# Altium schematic sheet Mini-WaveGen.SchDoc
size A4; SheetNumber: 3; SheetTotal: 7
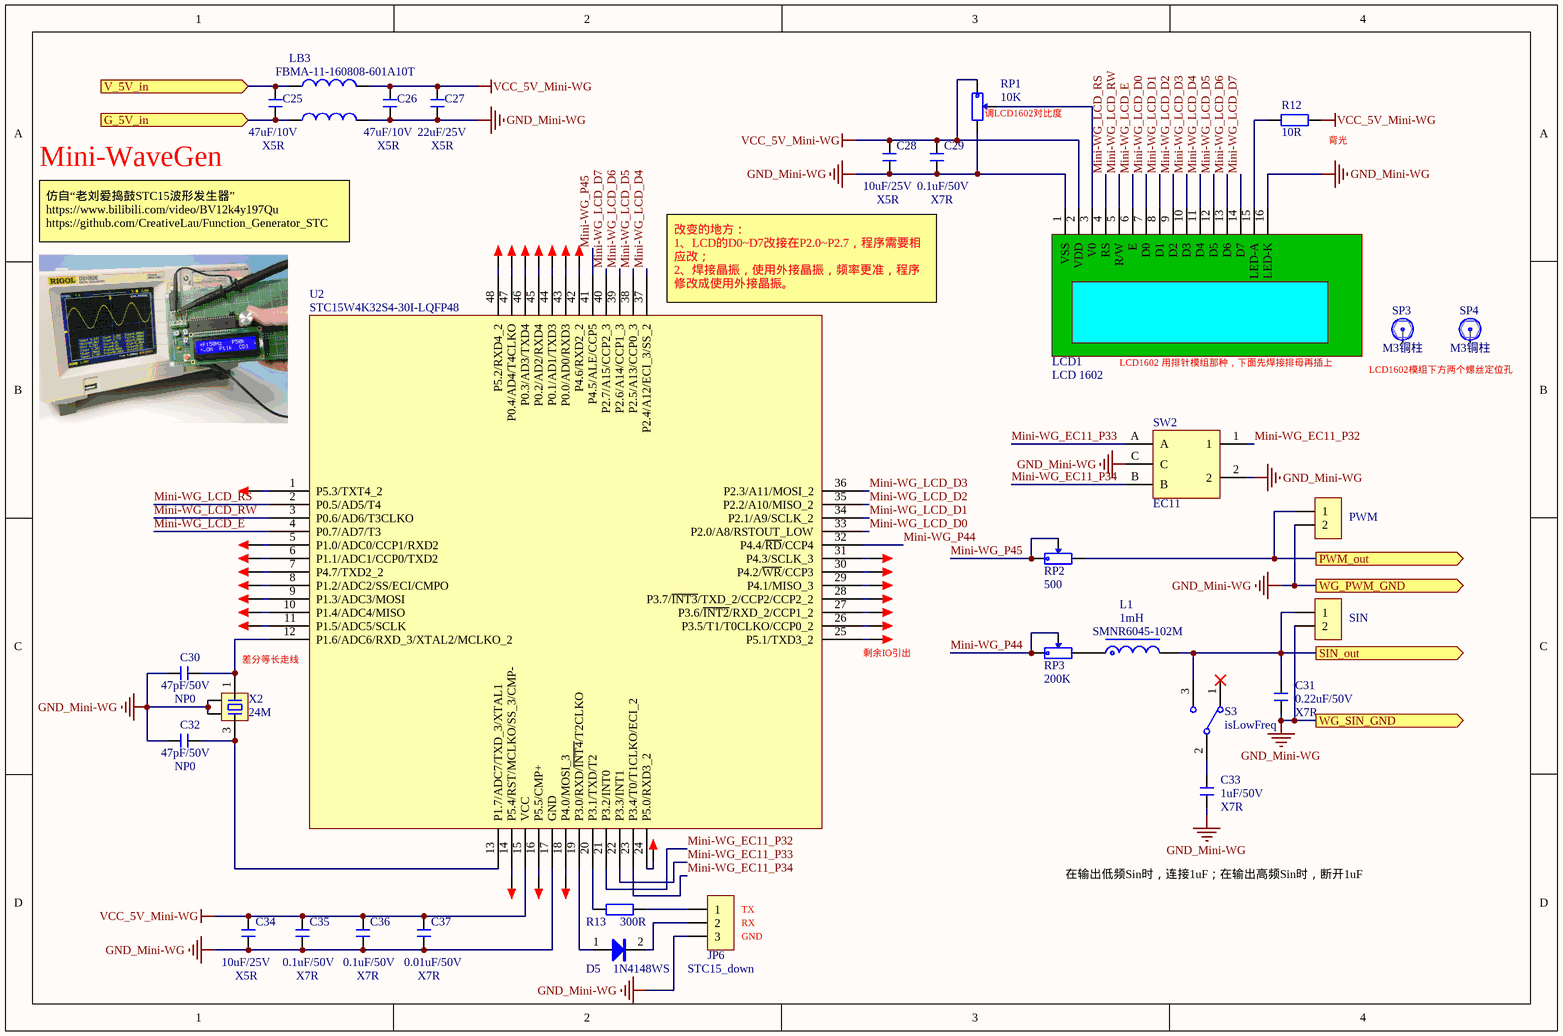
[diagram p0: Mini-WaveGen.SchDoc]

## Parts
C25  47uF/10V  BOM名称: X5R  [C 1206_L]
C26  47uF/10V  BOM名称: X5R  [C 1206_L]
C27  22uF/25V  BOM名称: X5R  [C 0805_L]
C28  10uF/25V  BOM名称: X5R  [C 0603_L]
C29  0.1uF/50V  BOM名称: X7R  [C 0402_L]
C30  47pF/50V  BOM名称: NP0  [C 0402_L]
C31  0.22uF/50V  BOM名称: X7R  [C 0603_L]
C32  47pF/50V  BOM名称: NP0  [C 0402_L]
C33  1uF/50V  BOM名称: X7R  [C 0603_L]
C34  10uF/25V  BOM名称: X5R  [C 0603_L]
C35  0.1uF/50V  BOM名称: X7R  [C 0402_L]
C36  0.1uF/50V  BOM名称: X7R  [C 0402_L]
C37  0.01uF/50V  BOM名称: X7R  [C 0402_L]
D5  1N4148WS  [SOD-323]
JP4  PWM  [HDR2.54-WS-2P]
JP5  SIN  [HDR2.54-WS-2P]
JP6  STC15_down  [HDR2.54-WS-3P]
L1  1mH  [NR6045]
LB3  FBMA-11-160808-601A10T  [FB 0603_L]
LB4  FBMA-11-160808-601A10T  [FB 0603_L]  (value not drawn)
LCD1  LCD 1602  [LCD-1602]
R12  10R  [R 0805_L]
R13  300R  [R 0402_L]
RP1  10K  [3362P]
RP2  500  [3362P]
RP3  200K  [3362P]
S3  isLowFreq  [MSK-12C01-07]
SP3  M3铜柱  [M3x4_L]
SP4  M3铜柱  [M3x4_L]
SW2  EC11  [EC11-B]
TP4  IO  [TEST 1]  (value not drawn)
TP5  IO  [TEST 1]  (value not drawn)
TP6  IO  [TEST 1]  (value not drawn)
TP7  IO  [TEST 1]  (value not drawn)
TP8  IO  [TEST 1]  (value not drawn)
TP9  IO  [TEST 1]  (value not drawn)
TP10  IO  [TEST 1]  (value not drawn)
TP11  IO  [TEST 1]  (value not drawn)
TP12  IO  [TEST 1]  (value not drawn)
TP13  IO  [TEST 1]  (value not drawn)
TP14  IO  [TEST 1]  (value not drawn)
TP15  IO  [TEST 1]  (value not drawn)
TP16  IO  [TEST 1]  (value not drawn)
TP17  IO  [TEST 1]  (value not drawn)
TP18  IO  [TEST 1]  (value not drawn)
TP19  IO  [TEST 1]  (value not drawn)
TP20  IO  [TEST 1]  (value not drawn)
TP21  IO  [TEST 1]  (value not drawn)
TP22  IO  [TEST 1]  (value not drawn)
TP23  IO  [TEST 1]  (value not drawn)
TP24  IO  [TEST 1]  (value not drawn)
TP25  IO  [TEST 1]  (value not drawn)
TP26  IO  [TEST 1]  (value not drawn)
TP27  IO  [TEST 1]  (value not drawn)
TP28  IO  [TEST 1]  (value not drawn)
TP29  IO  [TEST 1]  (value not drawn)
U2  STC15W4K32S4-30I-LQFP48  [LQFP48]
X2  24M  [OSC 3225-4P]

## Ports
G_5V_in (in), PWM_out (out), SIN_out (out), V_5V_in (in), WG_PWM_GND (out), WG_SIN_GND (out)

## Nets
GND_Mini-WG: C26.1 C27.1 C28.1 C29.2 C30.2 C31.2 C32.2 C33.1 C34.1 C35.2 C36.2 C37.2 JP4.2 JP5.2 JP6.3 LB4.2 LCD1.1(VSS) LCD1.16(LED-K) RP1.3 SW2.2 SW2.C U2.17(GND) X2.2 X2.4 ; port WG_PWM_GND, port WG_SIN_GND
VCC_5V_Mini-WG: C26.2 C27.2 C28.2 C29.1 C34.2 C35.1 C36.1 C37.1 LB3.2 LCD1.2(VDD) R12.1 RP1.1 U2.15(VCC)
G_5V_in: C25.1 LB4.1 ; port G_5V_in
Mini-WG_EC11_P32: SW2.1 U2.21(P3.2/INT0)
Mini-WG_EC11_P33: SW2.A U2.22(P3.3/INT1)
Mini-WG_EC11_P34: SW2.B U2.23(P3.4/T0/T1CLKO/ECI_2)
Mini-WG_LCD_D0: LCD1.7(D0) U2.33(P2.0/A8/RSTOUT_LOW)
Mini-WG_LCD_D1: LCD1.8(D1) U2.34(P2.1/A9/SCLK_2)
Mini-WG_LCD_D2: LCD1.9(D2) U2.35(P2.2/A10/MISO_2)
Mini-WG_LCD_D3: LCD1.10(D3) U2.36(P2.3/A11/MOSI_2)
Mini-WG_LCD_D4: LCD1.11(D4) U2.37(P2.4/A12/ECI_3/SS_2)
Mini-WG_LCD_D5: LCD1.12(D5) U2.38(P2.5/A13/CCP0_3)
Mini-WG_LCD_D6: LCD1.13(D6) U2.39(P2.6/A14/CCP1_3)
Mini-WG_LCD_D7: LCD1.14(D7) U2.40(P2.7/A15/CCP2_3)
Mini-WG_LCD_E: LCD1.6(E) U2.4(P0.7/AD7/T3)
Mini-WG_LCD_RS: LCD1.4(RS) U2.2(P0.5/AD5/T4)
Mini-WG_LCD_RW: LCD1.5(R/W) U2.3(P0.6/AD6/T3CLKO)
Mini-WG_P44: RP3.1 RP3.2 U2.32(P4.4/~{RD}/CCP4)
Mini-WG_P45: RP2.1 RP2.2 U2.41(P4.5/ALE/CCP5)
PWM_out: JP4.1 RP2.3 ; port PWM_out
SIN_out: C31.1 JP5.1 L1.2 S3.3 ; port SIN_out
V_5V_in: C25.2 LB3.1 ; port V_5V_in
NetC30_1: C30.1 U2.12(P1.6/ADC6/RXD_3/XTAL2/MCLKO_2) X2.1
NetC32_1: C32.1 U2.13(P1.7/ADC7/TXD_3/XTAL1) X2.3
NetC33_2: C33.2 S3.2
NetD5_1: D5.1(A) U2.19(P3.0/RXD/~{INT4}/T2CLKO)
NetD5_2: D5.2(K) JP6.2
NetJP6_1: JP6.1 R13.1
NetL1_1: L1.1 RP3.3
NetLCD1_3: LCD1.3(V0) RP1.2
NetLCD1_15: LCD1.15(LED-A) R12.2
NetR13_2: R13.2 U2.20(P3.1/TXD/T2)
NetTP4_1: TP4.1 U2.48(P5.2/RXD4_2)
NetTP5_1: TP5.1 U2.47(P0.4/AD4/T4CLKO)
NetTP6_1: TP6.1 U2.46(P0.3/AD3/TXD4)
NetTP7_1: TP7.1 U2.45(P0.2/AD2/RXD4)
NetTP8_1: TP8.1 U2.44(P0.1/AD1/TXD3)
NetTP9_1: TP9.1 U2.43(P0.0/AD0/RXD3)
NetTP10_1: TP10.1 U2.42(P4.6/RXD2_2)
NetTP11_1: TP11.1 U2.1(P5.3/TXT4_2)
NetTP12_1: TP12.1 U2.31(P4.3/SCLK_3)
NetTP13_1: TP13.1 U2.5(P1.0/ADC0/CCP1/RXD2)
NetTP14_1: TP14.1 U2.30(P4.2/~{WR}/CCP3)
NetTP15_1: TP15.1 U2.6(P1.1/ADC1/CCP0/TXD2)
NetTP16_1: TP16.1 U2.29(P4.1/MISO_3)
NetTP17_1: TP17.1 U2.7(P4.7/TXD2_2)
NetTP18_1: TP18.1 U2.28(P3.7/~{INT3}/TXD_2/CCP2/CCP2_2)
NetTP19_1: TP19.1 U2.8(P1.2/ADC2/SS/ECI/CMPO)
NetTP20_1: TP20.1 U2.27(P3.6/~{INT2}/RXD_2/CCP1_2)
NetTP21_1: TP21.1 U2.9(P1.3/ADC3/MOSI)
NetTP22_1: TP22.1 U2.26(P3.5/T1/T0CLKO/CCP0_2)
NetTP23_1: TP23.1 U2.10(P1.4/ADC4/MISO)
NetTP24_1: TP24.1 U2.25(P5.1/TXD3_2)
NetTP25_1: TP25.1 U2.11(P1.5/ADC5/SCLK)
NetTP26_1: TP26.1 U2.24(P5.0/RXD3_2)
NetTP27_1: TP27.1 U2.14(P5.4/RST/MCLKO/SS_3/CMP-)
NetTP28_1: TP28.1 U2.16(P5.5/CMP+)
NetTP29_1: TP29.1 U2.18(P4.0/MOSI_3)

Not connected (* = marked no-connect by the designer): S3 1*; SP3 1; SP4 1

## Notes on the sheet
- (near RP1) 调LCD1602对比度
- Mini-WaveGen
- (near R12) 背光
- 仿自“老刘爱捣鼓STC15波形发生器”
  https://www.bilibili.com/video/BV12k4y197Qu
  https://github.com/CreativeLau/Function_Generator_STC
- (near U2) 改变的地方：
  1、LCD的D0~D7改接在P2.0~P2.7，程序需要相应改；
  2、焊接晶振，使用外接晶振，频率更准，程序修改成使用外接晶振。
- LCD1602 用排针模组那种，下面先焊接排母再插上
- LCD1602模组下方两个螺丝定位孔
- (near TP24) 剩余IO引出
- 差分等长走线
- (near JP6) TX
- (near JP6) RX
- 在输出低频Sin时，连接1uF；在输出高频Sin时，断开1uF
- (near JP6) GND
- Title
- Start date:
- Revision:
- Sheet
- Last date:
- of
- Organization:
- Drawn by:
- Checked by:
- Size:
- A4

## Library data of the parts
C25-C28 C34 = C X5R: 无极性贴片电容 X5R
C29 C31 C33 C35-C37 = C X7R: 无极性贴片电容 X7R
C30 C32 = C NP0: 无极性贴片电容 NP0
D5 = 1N4148: 高速开关二极管; 版权归属: 源创客; BOM名称: 高速开关二极管; 学习资源: www.ooocke.com
JP4 JP5 = Header 2: 2P接插件; 版权归属: 源创客; BOM名称: 2P接插件; 学习资源: www.ooocke.com
JP6 = Header 3: 3P接插件; 版权归属: 源创客; BOM名称: 3P接插件; 学习资源: www.ooocke.com
L1 = L-NR: SMNR6045-102M; 版权归属: 源创客; BOM名称: SMNR6045-102M; 学习资源: www.ooocke.com
LB3 LB4 = LB: 磁珠 600R@100MHz; 版权归属: 源创客; BOM名称: 磁珠 600R@100MHz; 学习资源: www.ooocke.com
LCD1 = LCD 1602: 版权归属: 源创客; BOM名称: LCD 1602; 学习资源: www.ooocke.com
R12 R13 = R: 贴片电阻 E-96 1%; BOM名称: E-96 1%
RP1-RP3 = RP-ID: 插件单联电位器; BOM名称: 插件电位器; 版权归属: 源创客; 学习资源: www.ooocke.com
S3 = SSW-1P: 1路拨动开关; pin to pad: 1>3 3>1; BOM名称: 拨动开关; 版权归属: 源创客; 学习资源: www.ooocke.com
SP3 SP4 = 铜柱小焊盘: 铜柱; 版权归属: 源创客; BOM名称: 铜柱; 学习资源: www.ooocke.com
SW2 = EC11: 数字开关编码器; BOM名称: 数字编码开关; 版权归属: 源创客; 学习资源: www.ooocke.com
TP4-TP29 = TEST: 测试点; 版权归属: 源创客; BOM名称: 测试点; 学习资源: www.ooocke.com
U2 = STC15W4K60S4_LQFP48
X2 = XTAL-4P: 4脚无源晶振; 版权归属: 源创客; BOM名称: 4脚无源晶振; 学习资源: www.ooocke.com